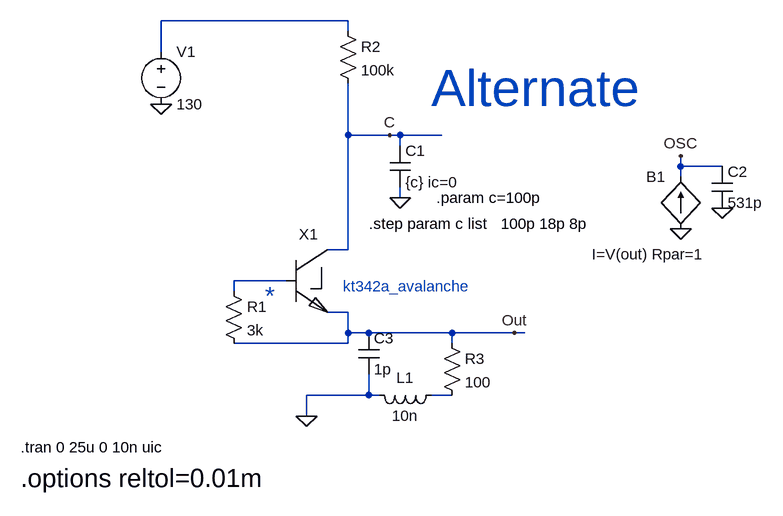
[diagram p0: schematic Ex4_KT342A.asc]
Ex4_KT342A.asc, the LTspice schematic file:
Version 4
SHEET 1 4432 680
WIRE 1440 -304 1152 -304
WIRE 1440 -288 1440 -304
WIRE 1152 -256 1152 -304
WIRE 1440 -128 1440 -208
WIRE 1504 -128 1440 -128
WIRE 1520 -128 1504 -128
WIRE 1584 -128 1520 -128
WIRE 1520 -112 1520 -128
WIRE 1952 -80 1952 -96
WIRE 2016 -80 1952 -80
WIRE 1952 -64 1952 -80
WIRE 1520 -32 1520 -48
WIRE 1440 48 1440 -128
WIRE 1440 48 1408 48
WIRE 1344 96 1264 96
WIRE 1264 112 1264 96
WIRE 1440 144 1408 144
WIRE 1440 176 1440 144
WIRE 1472 176 1440 176
WIRE 1600 176 1472 176
WIRE 1696 176 1600 176
WIRE 1712 176 1696 176
WIRE 1440 192 1440 176
WIRE 1440 192 1264 192
WIRE 1600 192 1600 176
WIRE 1472 272 1472 240
WIRE 1472 272 1376 272
WIRE 1488 272 1472 272
WIRE 1600 272 1568 272
WIRE 1376 304 1376 272
FLAG 1376 304 0
FLAG 1152 -176 0
FLAG 1520 -32 0
FLAG 1696 176 Out
FLAG 1504 -128 C
FLAG 1952 -96 OSC
FLAG 1952 16 0
FLAG 2016 -16 0
SYMBOL res 1424 -304 R0
SYMATTR InstName R2
SYMATTR Value 100k
SYMBOL voltage 1152 -272 R0
WINDOW 123 0 0 Left 2
WINDOW 39 0 0 Left 2
SYMATTR InstName V1
SYMATTR Value 130
SYMBOL res 1584 176 R0
SYMATTR InstName R3
SYMATTR Value 100
SYMBOL cap 1504 -112 R0
SYMATTR InstName C1
SYMATTR Value {c} ic=0
SYMATTR SpiceLine Lser=5n
SYMBOL bi 1952 16 R180
WINDOW 0 24 80 Left 2
WINDOW 3 -37 -39 Left 2
SYMATTR InstName B1
SYMATTR Value I=V(out) Rpar=1
SYMBOL cap 2000 -80 R0
SYMATTR InstName C2
SYMATTR Value 531p
SYMBOL ind 1584 256 R90
WINDOW 0 5 56 VBottom 2
WINDOW 3 32 56 VTop 2
SYMATTR InstName L1
SYMATTR Value 10n
SYMBOL res 1248 96 R0
SYMATTR InstName R1
SYMATTR Value 3k
SYMBOL cap 1456 176 R0
SYMATTR InstName C3
SYMATTR Value 1p
SYMBOL KT342A_Avalanche 1376 96 R0
SYMATTR InstName X1
TEXT 936 352 Left 2 !.tran 0 25u 0 10n uic
TEXT 936 400 Left 4 !.options reltol=0.01m
TEXT 1312 120 Left 4 ;*
TEXT 1472 8 Left 2 !.step param c list   100p 18p 8p
TEXT 1576 -32 Left 2 !.param c=100p
TEXT 1568 -200 Left 6 ;Alternate
TEXT 1432 104 Left 2 ;kt342a_avalanche

The netlist it stands for:
* Ex4_KT342A.asc
R2 N001 C 100k
V1 N001 0 130
R3 Out N003 100
C1 C 0 {c} ic=0 Lser=5n
B1 0 OSC I=V(out) Rpar=1
C2 OSC 0 531p
L1 N003 0 10n
R1 N002 Out 3k
C3 Out 0 1p
XX1 N002 C Out KT342A_Avalanche  ; pins B C E
.tran 0 25u 0 10n uic
.options reltol=0.01m
* *
.step param c list   100p 18p 8p
.param c=100p
* Alternate
* kt342a_avalanche
.backanno
.end